# EAGLE schematic M3600_CAN_SPS_D_H_Cabin_Controller (EAGLE 9.6.2)
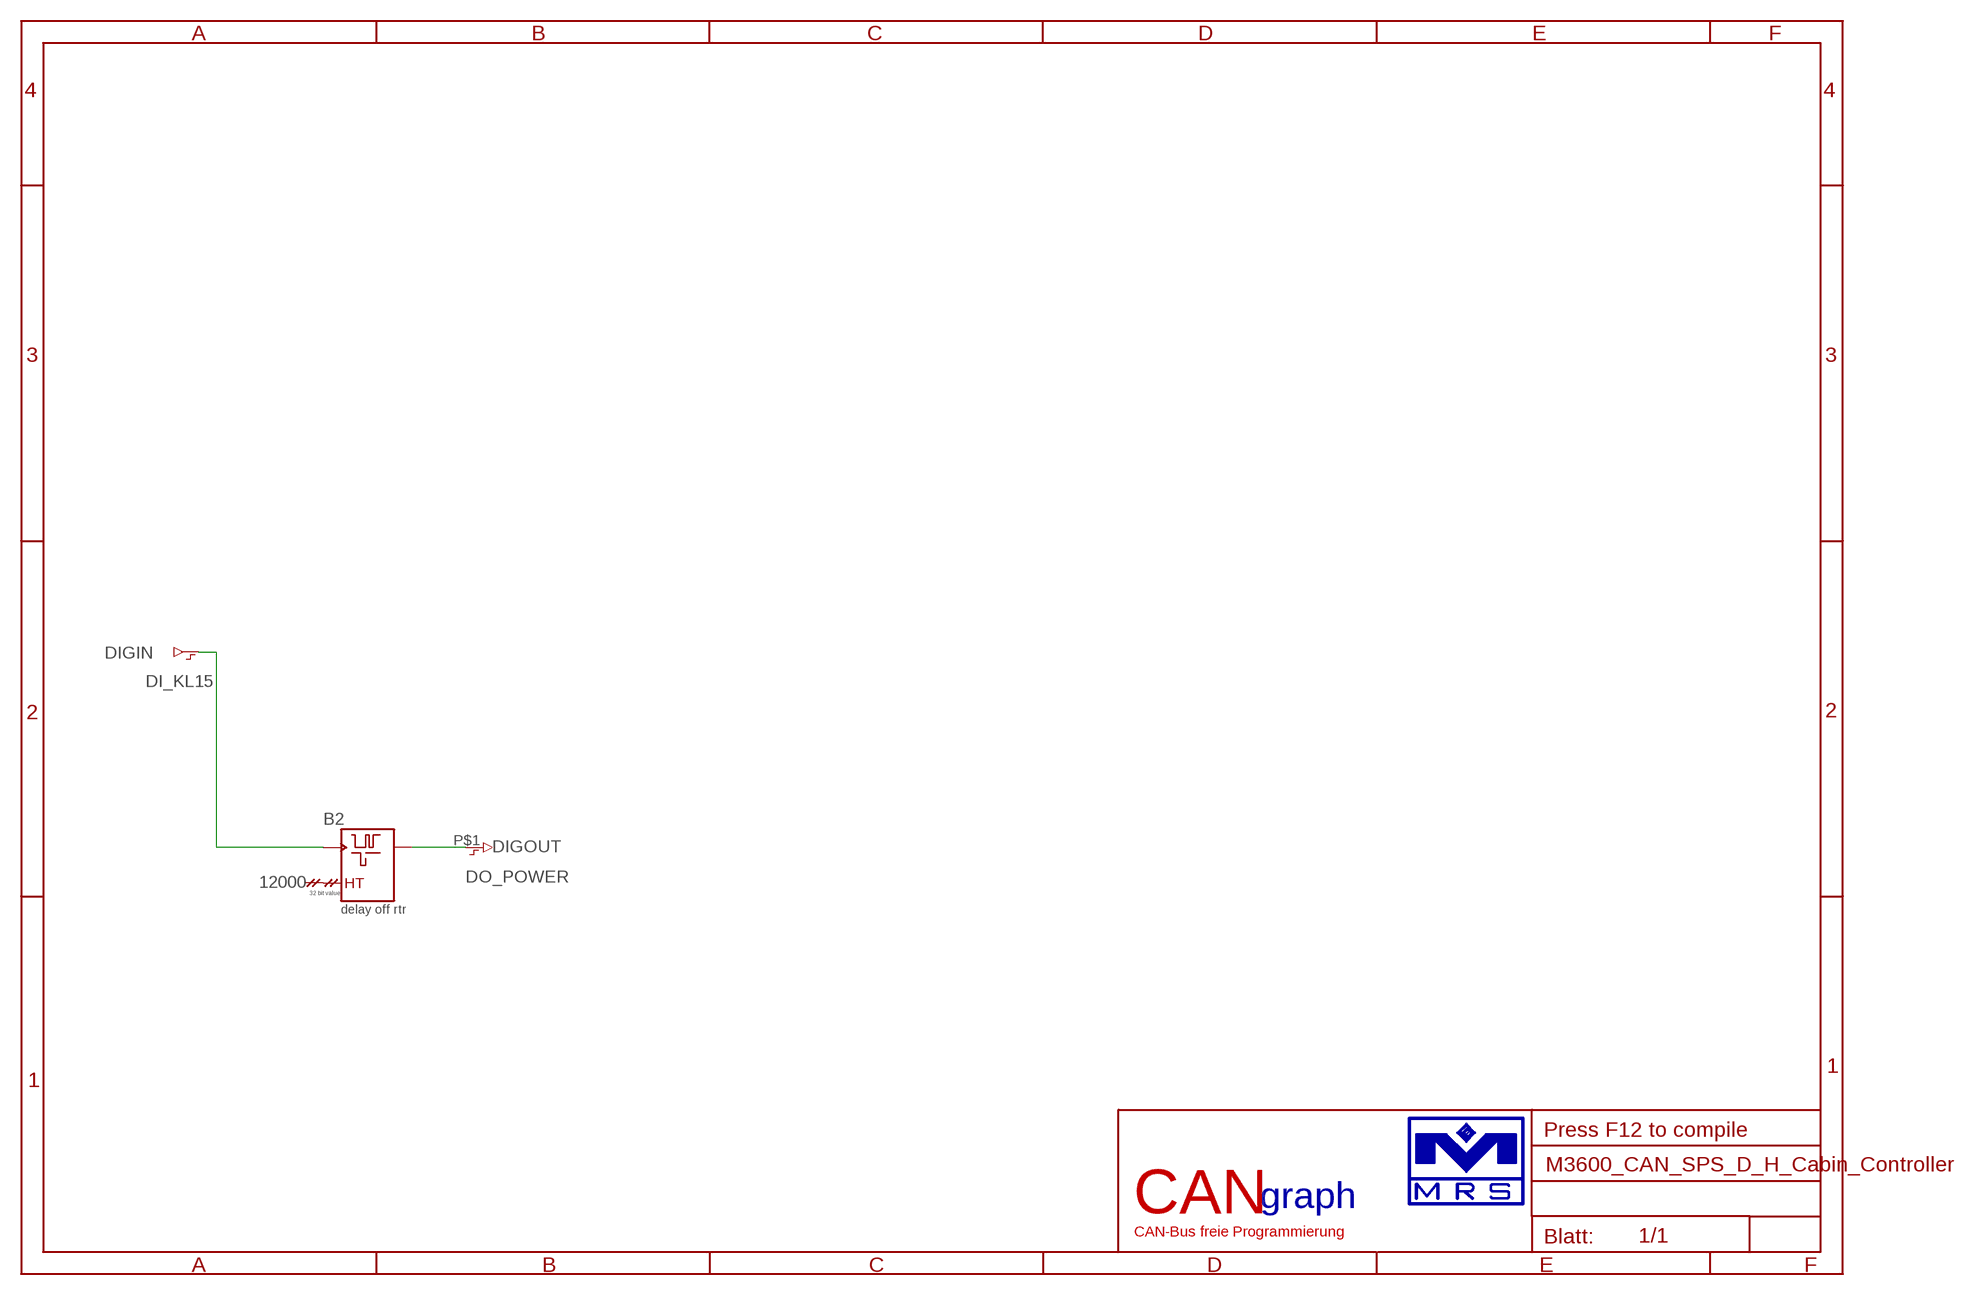
[diagram p0: schematic, sheet 1]

## Parts
B2  DELAY_OFF_RTR  [PACK_DUMMY]
DIGIN1  DI_KL15  DIGIN  [PACK_DUMMY]
DIGOUT2  DO_POWER  DIGOUT  [PACK_DUMMY]
VALUE#2  12000  VALUE  [PACK_DUMMY]

## Nets
N$1: B2.P$1(1_1) DIGIN1.P$1(EIN_1)
N$3: B2.P$2(2_32) VALUE#2.P$1(KONST_32)
N$5: B2.P$3(3_1) DIGOUT2.P$1(AUS_1)

## Library data of the parts
B2 = CANgraph:DELAY_OFF_RTR: Switch-off delay (retriggerable) A 1 at the input switches the output immediately to 1. If against the input for HT (rear time) to cycles permanently rests to 0, the output goes on 0 (retriggerable).
DIGIN1 = CANgraph:DIGIN: Digital input Reads a digital input. At which PIN the signal is read is written in the manual of CANgraph. The name of the PIN must be entered in the eagle component through the command "value".
DIGOUT2 = CANgraph:DIGOUT: Digital output Sets a digital output. At which PIN the signal is set is written in the manual of CANgraph. The name of the PIN must be entered in the eagle component through the command "value".
VALUE#2 = CANgraph:VALUE: Read in a fixed value This component reads in a number and puts it on a line to wiring with other components. The number has to be entered in the eagle component with the command "value". For a hexadecimal number put a '0x' in front of it.